# EAGLE design uv-dosimeter-featherwing-mk-1.3 (EAGLE 7.5.0)
AUTHOR: sean@yak.net
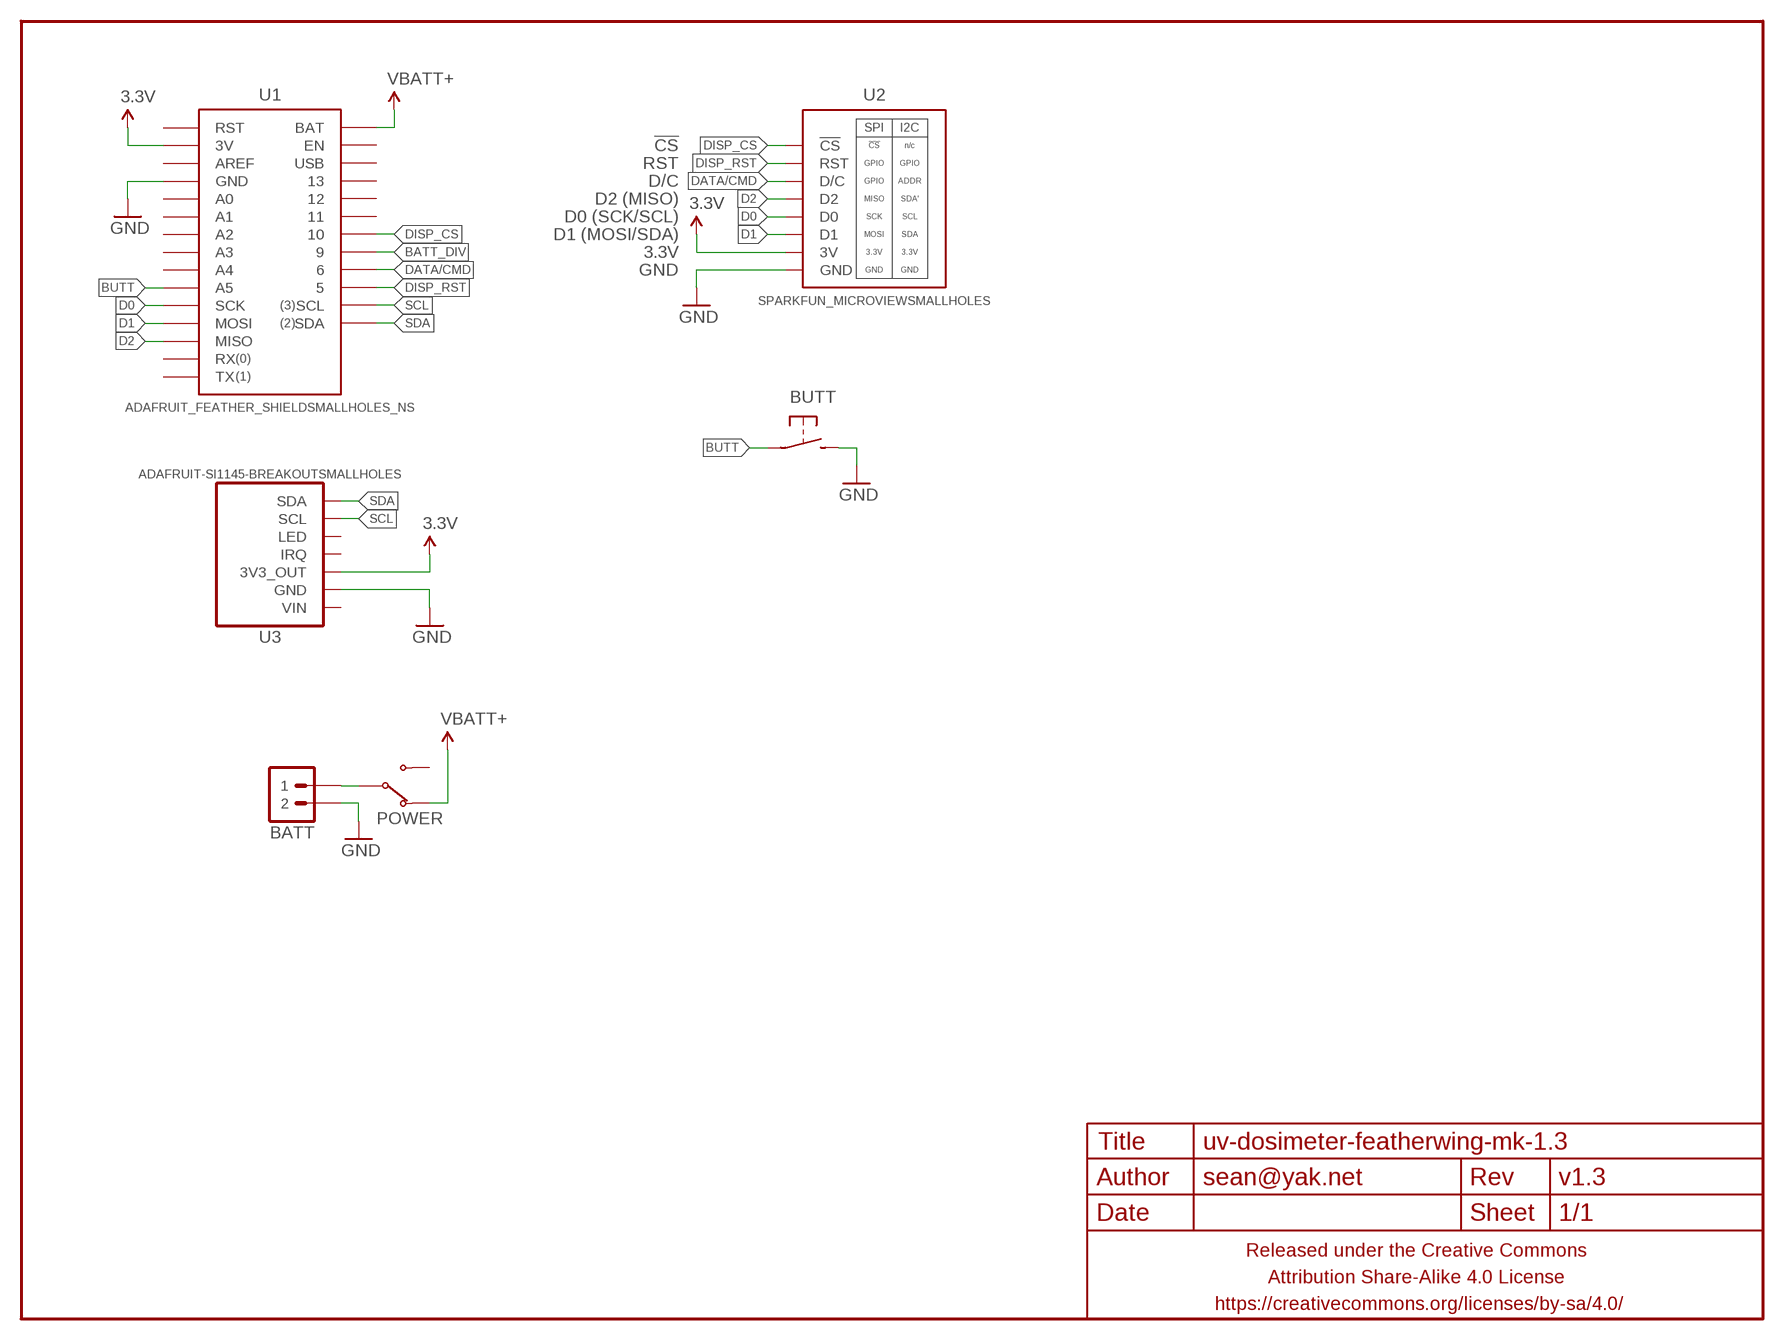
[diagram p0: schematic, sheet 1]

## Parts
BATT  M02JST-2MM-SMT  [JST-2-SMD]
BUTT  SPST-NO-TACT3MM-PTH-SMALL-PADS  [DTS-3-SMALL-PADS]
FRAME1  FRAME-LETTERNO_PACKAGE  [DUMMY]
POWER  SWITCH-SPDTPTH-VERT-2.54MM  [SWITCH-SPDT]
U1  ADAFRUIT_FEATHER_SHIELDSMALLHOLES_NS  [ADAFRUIT_FEATHER_SMALLHOLES_NS]
U2  SPARKFUN_MICROVIEWSMALLHOLES  [SPARKFUN-MICROVIEW-SMALLHOLES]
U3  ADAFRUIT-SI1145-BREAKOUTSMALLHOLES  [ADAFRUIT-SI1145-BREAKOUT-LESSSILK-SMALLHOLES]

## Nets
3.3V: U1.3V U2.3V U3.3V3_OUT
BATT_DIV: U1.9
BUTT: BUTT.1 U1.A5
D0: U1.SCK U2.D0
D1: U1.MOSI U2.D1
D2: U1.MISO U2.D2
DATA/CMD: U1.6 U2.D/C
DISP_CS: U1.10 U2.CS(!CS)
DISP_RST: U1.5 U2.RST
GND: BATT.1 BUTT.2 U1.GND@0(GND) U1.GND@1(GND) U2.GND U3.GND
N$1: BATT.2 POWER.2(COM)
SCL: U1.SCL U3.SCL
SDA: U1.SDA U3.SDA
VBATT+: POWER.1(NC) U1.BAT
Unconnected: POWER.3(NO) U1.11 U1.12 U1.13 U1.A0 U1.A1 U1.A2 U1.A3 U1.A4 U1.AREF U1.EN U1.RST U1.RX U1.TX U1.USB U3.IRQ U3.LED U3.VIN

## Notes on the sheet
- !CS
- RST
- D/C
- D2 (MISO)
- D0 (SCK/SCL)
- D1 (MOSI/SDA)
- 3.3V
- GND

## Library data of the parts
BATT = a_parts:M02: Standard 2-pin 0.1" header. Use with - straight break away headers ( PRT-00116) - right angle break away headers (PRT-00553) - swiss pins (PRT-00743) - machine pins (PRT-00117) - female headers (PRT-00115) Molex polarized connector foot print use with: PRT-08233 with associated crimp pins and housings. 2.54_SCREWTERM for use with PRT-10571. 3.5mm Screw Terminal footprints for PRT-08084 5mm Screw Terminal footprints for use with PRT-08433; PROD_ID: CONN-08352
BUTT = a_parts:SPST-NO-TACT
FRAME1 = A_butts:FRAME-LETTER: Schematic Frame Standard 8.5x11 US Letter frame; DESIGNER: sean@yak.net; VERSION: v1.3
POWER = a_parts:SWITCH-SPDT
U1 = a_parts:ADAFRUIT_FEATHER_SHIELD
U2 = a_parts:SPARKFUN_MICROVIEW
U3 = a_parts:ADAFRUIT-SI1145-BREAKOUT

## Board
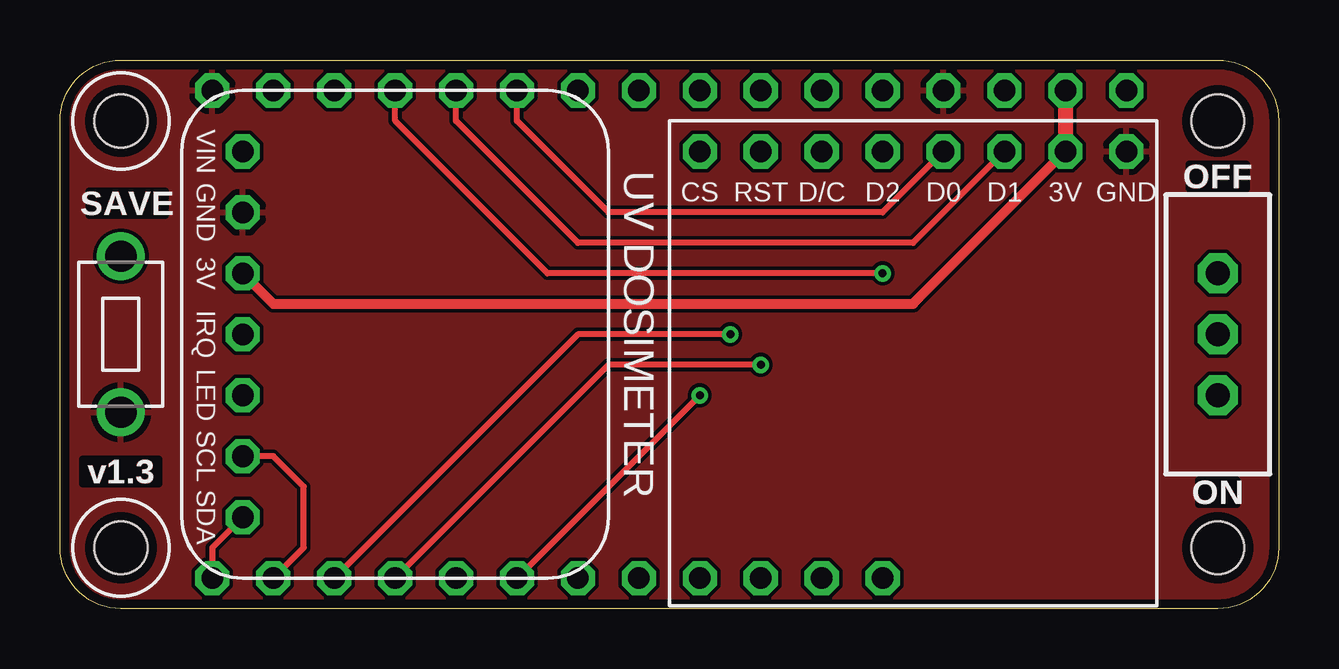
[diagram p1: board, top side]
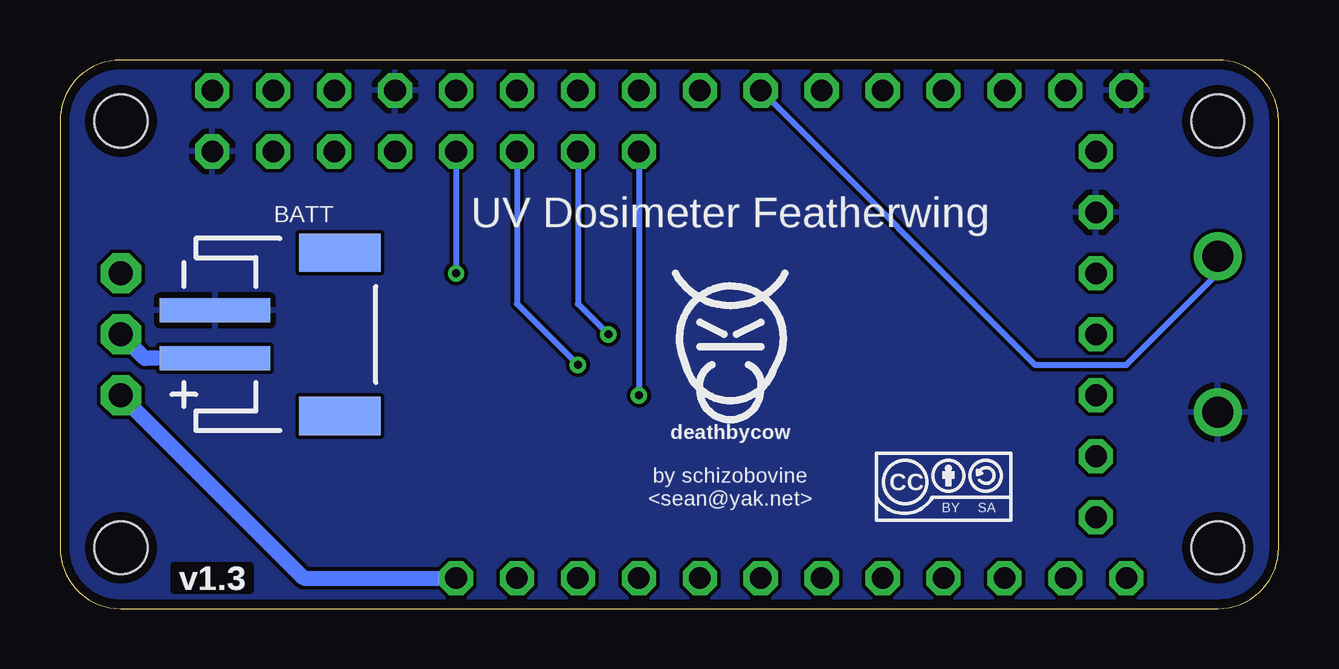
[diagram p2: board, bottom side, seen from below]

Size 50.8 x 22.86 mm. Coordinates in mm from the lower left corner, seen from the top.
Outline: 48.26,0 2.54,0 arc-90 0,2.54 0,20.32 arc-90 2.54,22.86 48.26,22.86 arc-90 50.8,20.32 50.8,2.54 arc-90 48.26,0
Copper layers (1*16): Top 0.0356mm / dielectric 1.5011mm / Bottom 0.0356mm
Design rules "LaenPCBOrder_2": minimum track width 6mil, minimum drill 13mil, track to track 6mil, track to pad 6mil, pad to pad 6mil, via to via 6mil, smd to smd 6mil, copper to edge 15mil, drill to drill 6mil, minimum pad ring 7mil, minimum via ring 7mil, stop-mask expansion 3mil, vias tented up to drill 20mil, thermal gap 10mil
Holes 2.2 mm at 48.26,2.54 48.26,20.32 2.54,20.32 2.54,2.54

### Footprints (pad centres in the part's own frame; a part is rotated, then mirrored left to right if it is on the bottom)
JST-2-SMD = smd 1 x 4.6: 1 -1,-3.7; 2 1,-3.7 | smd 1.6 x 3.4: NC1 -3.4,1.5; NC2 3.4,1.5
DTS-3-SMALL-PADS = drill 1.3 pad 2: 1 -3.25,0; 2 3.25,0
SWITCH-SPDT = drill 1 pad 1.676 octagon: 1 0,2.54; 2 0,0; 3 0,-2.54
ADAFRUIT_FEATHER_SMALLHOLES_NS = drill 0.9 pad 1.422 octagon: 3V -16.51,-10.16; 5 13.97,10.16; 6 11.43,10.16; 9 8.89,10.16; 10 6.35,10.16; 11 3.81,10.16; 12 1.27,10.16; 13 -1.27,10.16; A0 -8.89,-10.16; A1 -6.35,-10.16; A2 -3.81,-10.16; A3 -1.27,-10.16; A4 1.27,-10.16; A5 3.81,-10.16; AREF -13.97,-10.16; BAT -8.89,10.16; EN -6.35,10.16; GND@0 -11.43,-10.16; GND@1 19.05,-10.16; MISO 11.43,-10.16; MOSI 8.89,-10.16; RST -19.05,-10.16; RX 13.97,-10.16; SCK 6.35,-10.16; SCL 16.51,10.16; SDA 19.05,10.16; TX 16.51,-10.16; USB -3.81,10.16
SPARKFUN-MICROVIEW-SMALLHOLES = drill 0.9 pad 1.422 octagon: 3V 6.35,8.89; CS -8.89,8.89; D0 1.27,8.89; D1 3.81,8.89; D2 -1.27,8.89; D/C -3.81,8.89; GND 8.89,8.89; RST -6.35,8.89
ADAFRUIT-SI1145-BREAKOUT-LESSSILK-SMALLHOLES = drill 0.9 pad 1.422 octagon: 3V3_OUT -2.54,-6.35; GND -5.08,-6.35; IRQ 0,-6.35; LED 2.54,-6.35; SCL 5.08,-6.35; SDA 7.62,-6.35; VIN -7.62,-6.35

### Placement (x,y rotation side)
BATT  40.64,11.43 270 bottom
BUTT  2.54,11.43 270 top
FRAME1  0,0 90 bottom
POWER  48.26,11.43 180 top
U1  25.4,11.43 180 top
U2  35.56,10.16 0 top
U3  13.97,11.43 270 top
U$1  [COW_SMALL]  22.86,11.43 0 bottom
U$5  [CC-BY-SA-4.0-NO-URL]  13.97,5.08 0 bottom

### Tracks (layer width: path | path; a pad name or v marks a point on that pad's centre or on a via)
3.3V
  Top 0.406: U3.3V3_OUT 8.89,12.7 35.56,12.7 U2.3V
  Top 0.635: U1.3V U2.3V
BUTT
  Bottom 0.254: U1.A5 10.16,10.16 6.35,10.16 2.54,13.97 BUTT.1
D0
  Top 0.254: U2.D0 34.29,16.51 22.86,16.51 19.05,20.32 U1.SCK
D1
  Top 0.254: U2.D1 35.56,15.24 21.59,15.24 16.51,20.32 U1.MOSI
D2  (via drill 0.33)
  Top 0.254: v34.29,13.97 20.32,13.97 13.97,20.32 U1.MISO
  Bottom 0.254: U2.D2 v34.29,13.97
DATA/CMD  (via drill 0.33)
  Top 0.254: v29.21,10.16 22.86,10.16 U1.6
  Bottom 0.254: U2.D/C 31.75,12.7 v29.21,10.16
DISP_CS  (via drill 0.33)
  Top 0.254: v26.67,8.89 U1.10
  Bottom 0.254: U2.CS v26.67,8.89
DISP_RST  (via drill 0.33)
  Top 0.254: v27.94,11.43 21.59,11.43 U1.5
  Bottom 0.254: U2.RST 29.21,12.7 v27.94,11.43
GND
  pour Top (rank 6): 48.26,0 2.54,0 arc-90 0,2.54 0,20.32 arc-90 2.54,22.86 48.26,22.86 arc-90 50.8,20.32 50.8,2.54 arc-90
  pour Bottom (rank 6): 48.26,0 2.54,0 arc-90 0,2.54 0,20.32 arc-90 2.54,22.86 48.26,22.86 arc-90 50.8,20.32 50.8,2.54 arc-90
N$1
  Bottom 0.635: BATT.2 47.26,10.43 POWER.2
SCL
  Top 0.254: U1.SCL 10.16,2.54 10.16,5.08 8.89,6.35 U3.SCL
SDA
  Top 0.254: U3.SDA 6.35,2.54 U1.SDA
VBATT+
  Bottom 0.635: POWER.1 40.64,1.27 U1.BAT

### Text on the board
Top: OFF | SAVE | ON
tPlace: OFF | SAVE | UV DOSIMETER | ON
bPlace: UV Dosimeter Featherwing | by schizobovine / <sean@yak.net>